# Altium schematic sheet Digital Ball Sensor.SchDoc
size A4
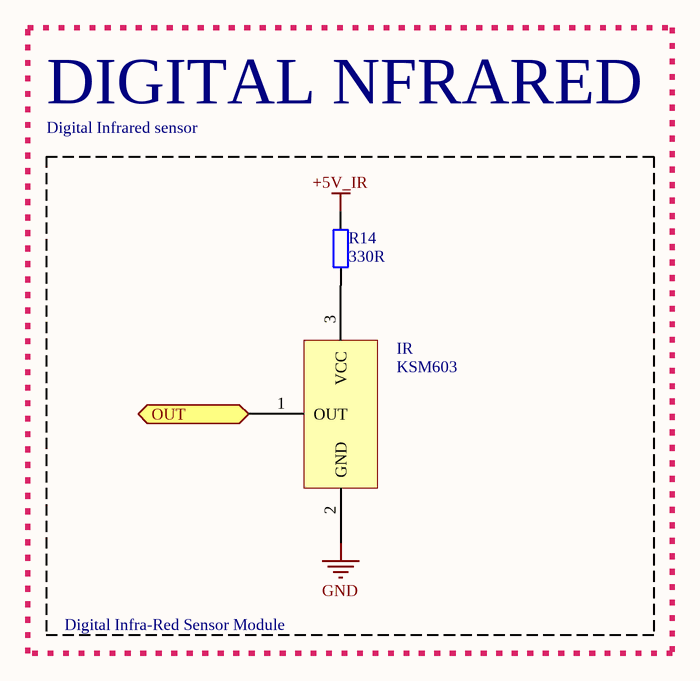
[diagram p0: Digital Ball Sensor.SchDoc]

## Parts
IR  KSM603  [KSM603]
R14  330R  [RES1206]

## Blocks framed on the sheet
DIGITAL NFRARED: IR R14

## Ports
OUT (out)

## Nets
+5V_IR: R14.2
GND: IR.2(GND)
OUT: IR.1(OUT) ; port OUT
NetIR_3: IR.3(VCC) R14.1

## Notes on the sheet
- Digital Infrared sensor
- Digital Infra-Red Sensor Module

## Library data of the parts
IR = DIGITAL-IR-SENSOR: Generic Infra Red Sensor
R14 = RES